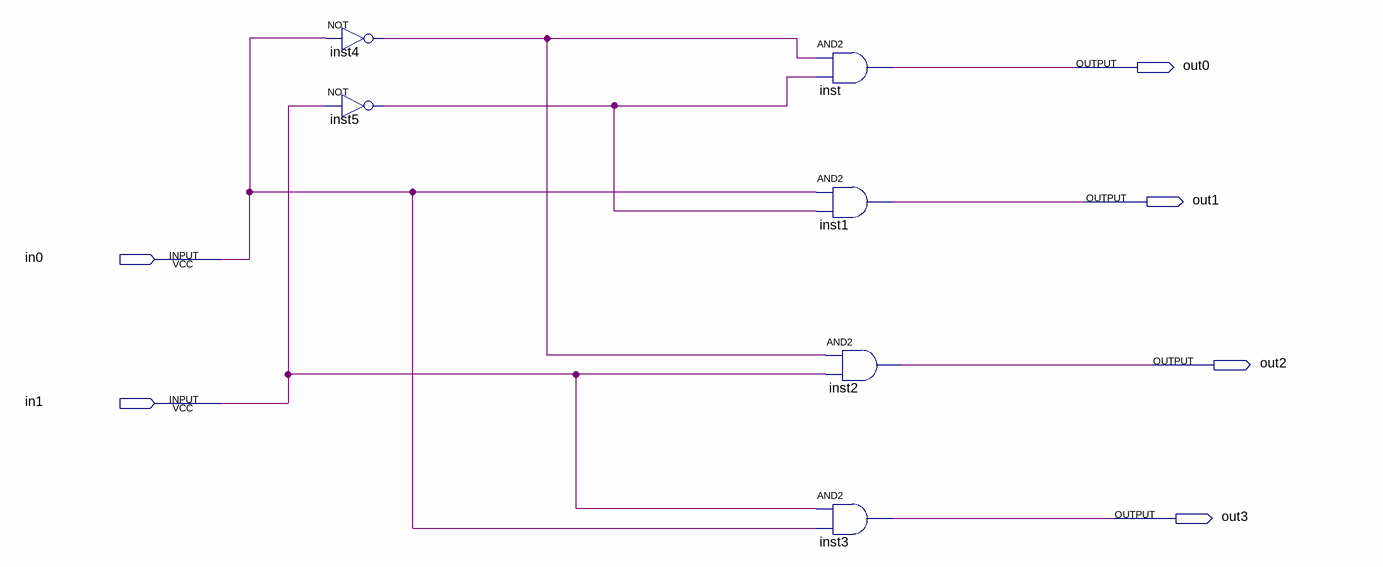
[diagram p0: schematic sheet]
// Quartus schematic decoder2by4.bdf as structural Verilog: 6 symbols, 6 pins
module decoder2by4 (
  input  in0,
  input  in1,
  output out0,
  output out1,
  output out2,
  output out3
);

  wire inst4_out, inst5_out;

  not inst4 (inst4_out, in0);
  not inst5 (inst5_out, in1);
  and inst (out0, inst4_out, inst5_out);
  and inst1 (out1, in0, inst5_out);
  and inst2 (out2, inst4_out, in1);
  and inst3 (out3, in1, in0);
endmodule
